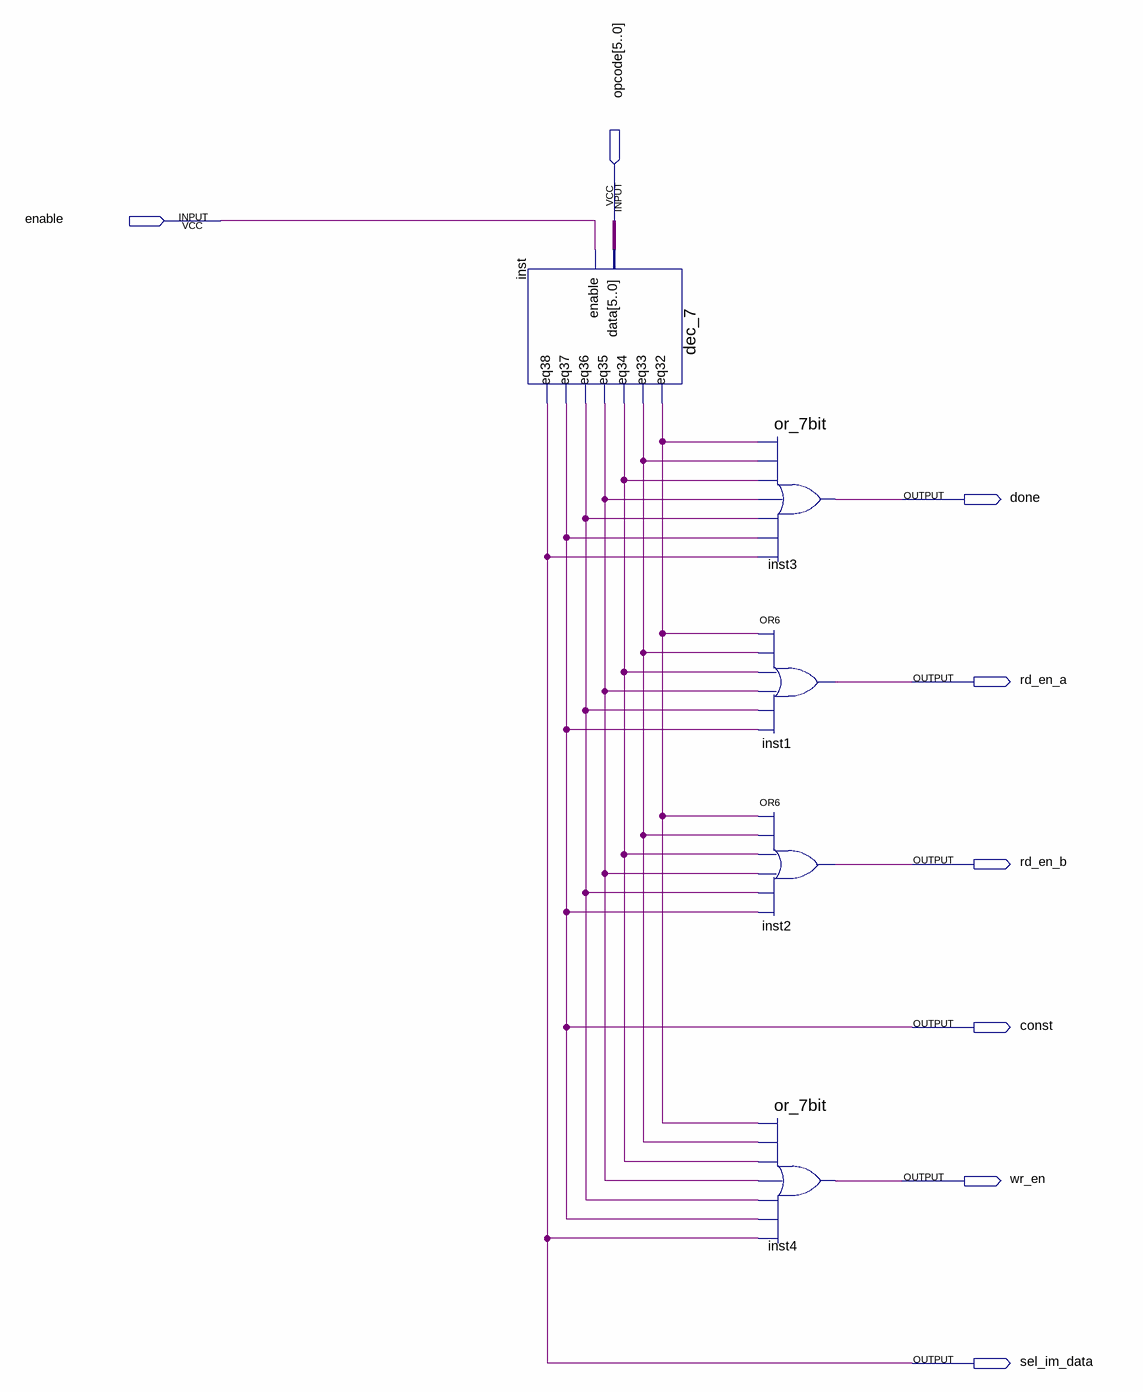
[diagram p0: schematic sheet]
// Quartus schematic CO_CU.bdf as structural Verilog: 5 symbols, 8 pins
module CO_CU (
  input  enable,
  input  [5:0] opcode,
  output done,
  output rd_en_a,
  output rd_en_b,
  output \const ,
  output wr_en,
  output sel_im_data
);

  wire inst_eq32, inst_eq33, inst_eq34, inst_eq35, inst_eq36;

  dec_7 inst (
    .data(opcode), .enable(enable), .eq32(inst_eq32), .eq33(inst_eq33), .eq34(inst_eq34), .eq35(inst_eq35),
    .eq36(inst_eq36), .eq37(\const ), .eq38(sel_im_data));
  or_7bit inst3 (
    .data0(inst_eq32), .data1(inst_eq33), .data2(inst_eq34), .data3(inst_eq35), .data4(inst_eq36),
    .data5(\const ), .data6(sel_im_data), .result(done));
  or inst1 (rd_en_a, inst_eq32, inst_eq33, inst_eq34, inst_eq35, inst_eq36, \const );
  or inst2 (rd_en_b, inst_eq32, inst_eq33, inst_eq34, inst_eq35, inst_eq36, \const );
  or_7bit inst4 (
    .data0(inst_eq32), .data1(inst_eq33), .data2(inst_eq34), .data3(inst_eq35), .data4(inst_eq36),
    .data5(\const ), .data6(sel_im_data), .result(wr_en));
endmodule
